# Altium schematic sheet Power.SchDoc: ALICE FIT CFD Mezzanine
size 420 x 297 mm; CheckedBy: G.Kasprowicz; Author: INR Moscow; CompanyName: WUT ISE; DrawnBy: Maciej Podgóski; Organization: WUT ISE; Address1: PW ISE; Address2: Nowowiejska 15/19 00-665 Warsaw; Address3: gkasprow@gmail.com; DocumentNumber: 4; Revision: 2; SheetNumber: 4; SheetTotal: 5; ModifiedBy: -; CheckedDate: -; Title2: Power supply; DivGrp: WUT ISE; Designer: INR Moscow; ModifiedDate: -; ProjectName: Sensor Box
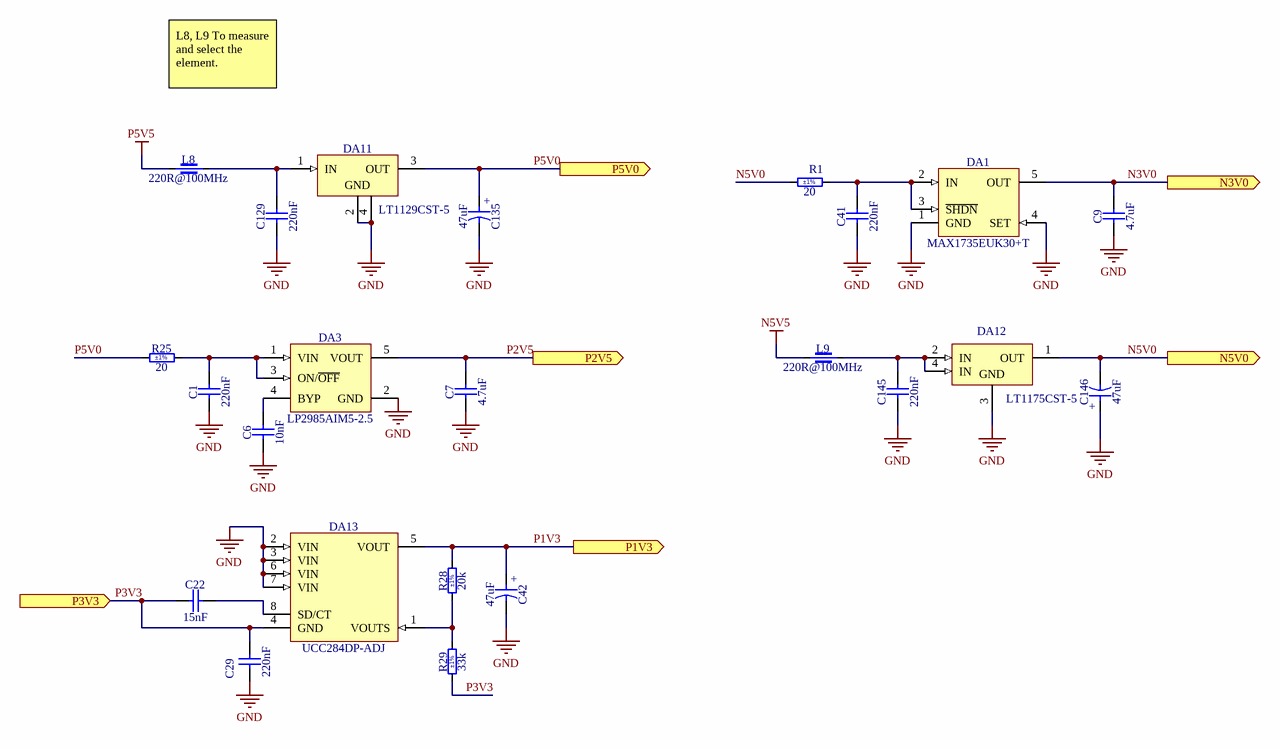
[diagram p0: Power.SchDoc]

## Parts
C1  220nF  [CAPC2012X135N]
C6  10nF  [CAPC2012X135N]
C7  4.7uF  [CAPC2012X135N]
C9  4.7uF  [CAPC2012X135N]
C22  15nF  [CAPC2012X135N]
C29  220nF  [CAPC2012X135N]
C41  220nF  [CAPC2012X135N]
C42  47uF  [CAPAE530X610N]
C129  220nF  [CAPC2012X135N]
C135  47uF  [CAPAE530X610N]
C145  220nF  [CAPC2012X135N]
C146  47uF  [CAPAE530X610N]
DA1  MAX1735EUK30+T  [SOT95P280X145-5N]
DA3  LP2985AIM5-2.5  [SOT95P280X145-5N]
DA11  LT1129CST-5  [SOT230P700X180-4N]
DA12  LT1175CST-5  [SOT230P700X180-4N]
DA13  UCC284DP-ADJ  [SOIC127P600X175-8N]
L8  220R@100MHz  [INDC2012X105N]
L9  220R@100MHz  [INDC2012X105N]
R1  20  Tolerance: ±1%  [RESC2012X60N]
R25  20  Tolerance: ±1%  [RESC2012X60N]
R28  20k  Tolerance: ±1%  [RESC2012X60N]
R29  33k  Tolerance: ±1%  [RESC2012X60N]

## Ports
N3V0 (out), N5V0 (out), P1V3 (out), P2V5 (out), P3V3 (in), P5V0 (out)

## Nets
GND: C1.1 C6.1 C7.1 C9.1 C29.1 C41.1 C42.2 C129.1 C135.2 C145.1 C146.1 DA1.1(GND) DA1.4(SET) DA3.2(GND) DA11.2(GND) DA11.4(GND) DA12.3(GND) DA13.2(VIN) DA13.3(VIN) DA13.6(VIN) DA13.7(VIN)
N5V5: L9.1
P5V5: L8.1
N3V0: C9.2 DA1.5(OUT) ; port N3V0
N5V0: C146.2 DA12.1(OUT) R1.1 ; port N5V0
P1V3: C42.1 DA13.5(VOUT) R28.2 ; port P1V3
P2V5: C7.2 DA3.5(VOUT) ; port P2V5
P3V3: C22.1 C29.2 DA13.4(GND) R29.1 ; port P3V3
P5V0: C135.1 DA11.3(OUT) R25.1 ; port P5V0
NetC1_2: C1.2 DA3.1(VIN) DA3.3(ON/~{OFF}) R25.2
NetC6_2: C6.2 DA3.4(BYP)
NetC22_2: C22.2 DA13.8(SD/CT)
NetC41_2: C41.2 DA1.2(IN) DA1.3(~{SHDN}) R1.2
NetC129_2: C129.2 DA11.1(IN) L8.2
NetC145_2: C145.2 DA12.2(IN) DA12.4(IN) L9.2
NetDA13_1: DA13.1(VOUTS) R28.1 R29.2

## Notes on the sheet
- L8, L9 To measure and select the element.
- Project/Equipment
- Document
- Designer
- Drawn by
- Check.by
- Copyright WUT ISE 2024.
  This documentation describes Open Hardware and is licensed under the CERN OHL v.2. You may redistribute and modify this documentation under the terms of the CERN OHL v.2. (http://ohwr.org/CERNOHL). This documentation is distributed WITHOUT ANY EXPRESS OR IMPLIED WARRANTY, INCLUDING OF MERCHANTABILITY, SATISFACTORY QUALITY AND FITNESS FOR A PARTICULAR PURPOSE. Please see the CERN OHL v.2 for applicable conditions.
- Contact
- File
- Last Mod.
- Print Date
- Sheet
- Size
- A3
- of
- Rev
- (in symbol CAE530-610_47UF_16V_20%) +

## Library data of the parts
C1 C29 C41 C129 C145 = CC0805_220NF_50V_10%_X7R: Non-polarised capacitor; Part Description: SMD Multilayer Chip Ceramic Capacitor; Manufacturer: GENERIC; Manufacturer1 Part Number: GRM21BR71H224KA01L; Voltage: 50V; TC: X7R; Tolerance: ±10%; Part Number: CC0805_220NF_50V_10%_X7R; Component Kind: Standard; Component Type: Standard; Pin Count: 2; Value: 220nF; Status: Preferred; Manufacturer Part Number: CC0805_220NF_50V_10%_X7R; Case: 0805; Mounted: Yes; Socket: No; SMD: Yes; Sense: No; Manufacturer1 Example: MURATA; Manufacturer1 ComponentHeight: 1.35mm; HelpURL: \\cern.ch\dfs\Applications\Altium\Datasheets\CC0805_X7R_MURATA.pdf; Author: CERN DEM JLC; CreateDate: 03.12.2007; LatestRevisionDate: 03.12.2007
C6 = CC0805_10NF_50V_5%_C0G: Non-polarised capacitor; Part Description: SMD Multilayer Chip Ceramic Capacitor; Manufacturer: GENERIC; Manufacturer1 Part Number: C0805C103J5GACTU; Voltage: 50V; TC: C0G/NP0; Tolerance: ±5%; Part Number: CC0805_10NF_50V_5%_C0G; Component Kind: Standard; Component Type: Standard; Pin Count: 2; Value: 10nF; Status: None; Manufacturer Part Number: CC0805_10NF_50V_5%_C0G; Case: 0805; Mounted: Yes; Socket: No; SMD: Yes; Sense: No; Manufacturer1 Example: KEMET; Manufacturer1 ComponentHeight: 0.88mm; HelpURL: \\cern.ch\dfs\Applications\Altium\Datasheets\CC0805_C0G_KEMET_(Commercial Grade).pdf; Author: CERN DEM JLC; CreateDate: 02.02.2011; LatestRevisionDate: 22.04.2015
C7 C9 = CC0805_4.7UF_16V_10%_X7R: Non-polarised capacitor; Part Description: SMD Multilayer Chip Ceramic Capacitor; Manufacturer: GENERIC; Manufacturer1 Part Number: EMK212B7475KG-T; Voltage: 16V; TC: X7R; Tolerance: ±10%; Part Number: CC0805_4.7UF_16V_10%_X7R; Component Kind: Standard; Component Type: Standard; Pin Count: 2; Value: 4.7uF; Status: Preferred; Manufacturer Part Number: CC0805_4.7UF_16V_10%_X7R; Case: 0805; Mounted: Yes; Socket: No; SMD: Yes; Sense: No; Manufacturer1 Example: TAIYO YUDEN; Manufacturer1 ComponentHeight: 1.35mm; HelpURL: \\cern.ch\dfs\Applications\Altium\Datasheets\CC0805_X7R_TAIYO-YUDEN_HIGH-VALUE.pdf; Author: CERN DEM JLC; CreateDate: 16.09.2014; LatestRevisionDate: 16.09.2014
C22 = CC0805_15NF_50V_10%_X7R: Non-polarised capacitor; Part Description: SMD Multilayer Chip Ceramic Capacitor; Manufacturer: GENERIC; Manufacturer1 Part Number: 223858615638; Voltage: 50V; TC: X7R; Tolerance: ±10%; Part Number: CC0805_15NF_50V_10%_X7R; Component Kind: Standard; Component Type: Standard; Pin Count: 2; Value: 15nF; Status: Preferred; Manufacturer Part Number: CC0805_15NF_50V_10%_X7R; Case: 0805; Mounted: Yes; Socket: No; SMD: Yes; Sense: No; Manufacturer1 Example: PHYCOMP; Manufacturer1 ComponentHeight: 1.35mm; HelpURL: \\cern.ch\dfs\Applications\Altium\Datasheets\CC0805_X7R_PHYCOMP.pdf; Author: CERN DEM JLC; CreateDate: 03.12.2007; LatestRevisionDate: 03.12.2007
C42 C135 C146 = CAE530-610_47UF_16V_20%: Polarised capacitor; Part Description: Conductive Polymer Hybrid Aluminum Electrolytic Capacitor; Manufacturer: CHEMI-CON; Manufacturer Part Number: HHXD160ARA470ME61G; Voltage: 16V; Tolerance: ±20%; Part Number: CAE530-610_47UF_16V_20%; Component Kind: Standard; Component Type: Standard; Pin Count: 2; Value: 47uF; Status: Not Recommended; Case: C; Mounted: Yes; Socket: No; SMD: Yes; Sense: No; ComponentHeight: 6.1mm; HelpURL: \\cern.ch\dfs\Applications\Altium\Datasheets\CAE_CHIMI-CON_HXD.pdf; Author: CERN DEM HF; CreateDate: 15.04.2024; LatestRevisionDate: 15.04.2024
DA1 = MAX1735EUK30+T: 200mA, Negative-Output, Low-Dropout Linear Regulator; Part Description: 3V, 200mA, Negative-Output, Low-Dropout Linear Regulator; Manufacturer: MAXIM; PressFit: No; Bonding: No; Part Number: MAX1735EUK30+T; Component Kind: Standard; Component Type: Standard; Device: MAX1735EUK30+T; PackageDescription: SOT23, 0.95mm Pitch; 5 Pin, 1.60mm W X 2.90mm L X 1.45mm H body, IPC Medium Density; Manufacturer Part Number: MAX1735EUK30; Pin Count: 5; Case: SOT23-5; Mounted: Yes; Socket: No; SMD: Yes; Sense: No; ComponentHeight: 1.45mm; HelpURL: \\cern.ch\dfs\Applications\Altium\Datasheets\MAX1735EUK30+T.pdf; Author: CERN DEM JLC; CreateDate: 17.02.2010; LatestRevisionDate: 04.04.2022
DA3 = LP2985AIM5-2.5: 150mA Low-Noise Low-Dropout Regulator Whit Shutdown; Part Description: 2.5V, 150mA Low-Noise Low-Dropout Regulator Whit Shutdown; Manufacturer: TEXAS INSTRUMENTS; PressFit: No; Bonding: No; Part Number: LP2985AIM5-2.5; Component Kind: Standard; Component Type: Standard; Device: LP2985AIM5-2.5; PackageDescription: SOT23, 0.95mm Pitch; 5 Pin, 1.60mm W X 2.90mm L X 1.45mm H body, IPC Medium Density; Manufacturer Part Number: LP2985AIM5-2.5; Pin Count: 5; Case: SOT23-5; Mounted: Yes; Socket: No; SMD: Yes; Sense: No; ComponentHeight: 1.45mm; HelpURL: \\cern.ch\dfs\Applications\Altium\Datasheets\LP2985AIM5.pdf; Author: CERN DEM HF; CreateDate: 16.04.2024; LatestRevisionDate: 16.04.2024
DA11 = LT1129CST-5: 3-Terminal Regulator 1=IN 2=GND 3=OUT 4=GND; Part Description: 5V, 700mA Micropower Low Dropout Regulator with Shutdown; Manufacturer: LINEAR TECHNOLOGY; PressFit: No; Bonding: No; Part Number: LT1129CST-5; Component Kind: Standard; Component Type: Standard; Device: LT1129CST-5; PackageDescription: SOT223, 2.30mm Pitch; 4 Pin, 3.70mm W X 6.70mm L X 1.80mm H body, IPC Medium Density; Manufacturer Part Number: LT1129CST-5; Pin Count: 4; Case: SOT223; Mounted: Yes; Socket: No; SMD: Yes; Sense: No; ComponentHeight: 1.8mm; HelpURL: \\cern.ch\dfs\Applications\Altium\Datasheets\LT1129.pdf; Author: CERN DEM HF; CreateDate: 16.04.2024; LatestRevisionDate: 16.04.2024
DA12 = LT1175CST-5: 3-Terminal Regulator 1=OUT 2=IN 3=GND 4=IN; Part Description: 5V 500mA Negative Low Dropout Micropower Regulator; Manufacturer: LINEAR TECHNOLOGY; PressFit: No; Bonding: No; Part Number: LT1175CST-5; Component Kind: Standard; Component Type: Standard; Device: LT1175CST-5; PackageDescription: SOT223, 2.30mm Pitch; 4 Pin, 3.70mm W X 6.70mm L X 1.80mm H body, IPC Medium Density; Manufacturer Part Number: LT1175CST-5; Pin Count: 4; Case: SOT223; Mounted: Yes; Socket: No; SMD: Yes; Sense: No; ComponentHeight: 1.8mm; HelpURL: \\cern.ch\dfs\Applications\Altium\Datasheets\LT1175.pdf; Author: CERN DEM HF; CreateDate: 16.04.2024; LatestRevisionDate: 16.04.2024
DA13 = UCC284DP-ADJ: 5V, 500mA Low-Dropout Negative Linear Regulator; Part Description: 5V, 500mA Low-Dropout Negative Linear Regulator, Adjustable Output; Manufacturer: TEXAS INSTRUMENTS; PressFit: No; Bonding: No; Part Number: UCC284DP-ADJ; Component Kind: Standard; Component Type: Standard; Device: UCC284DP-ADJ; PackageDescription: SOIC 8, Pitch 1.27mm, Body 4x5mm, IPC Medium Density; Manufacturer Part Number: UCC284DP-ADJ; Pin Count: 8; Case: SOIC8; Mounted: Yes; Socket: No; SMD: Yes; Sense: No; ComponentHeight: 1.75mm; HelpURL: \\cern.ch\dfs\Applications\Altium\Datasheets\UCC284DP-ADJ.pdf; Author: CERN DEM BR; CreateDate: 20.06.2019; LatestRevisionDate: 20.06.2019
L8 L9 = IND0805_TDK_MPZ2012S221A: Part Description: SMT Chip Bead for General Power Line (MPZ Series); Manufacturer: TDK; Power: 3A; Resistance: 0.04R; Tolerance: ±25%; Part Number: IND0805_TDK_MPZ2012S221A; Component Kind: Standard; Component Type: Standard; Pin Count: 2; Value: 220R@100MHz; Manufacturer Part Number: MPZ2012S221A; Case: 0805; Mounted: Yes; Socket: No; SMD: Yes; Sense: No; ComponentHeight: 1.05mm; HelpURL: \\cern.ch\dfs\Applications\Altium\Datasheets\IND0805_TDK_MPZ2012.pdf; Author: CERN DEM HF; CreateDate: 04.10.2021; LatestRevisionDate: 04.10.2021
R1 R25 = R0805_20R_1%_0.125W_100PPM: Resistor - 1%; Part Description: General Purpose Thick Film Chip Resistor; Manufacturer: GENERIC; Manufacturer1 Part Number: NRC10F20R0TRF; Power: 0.125W; TC: ±100ppm/°C; PressFit: No; Part Number: R0805_20R_1%_0.125W_100PPM; Component Kind: Standard; Component Type: Standard; Pin Count: 2; Value: 20; Status: Preferred; Manufacturer Part Number: R0805_20R_1%_0.125W_100PPM; Case: 0805; Mounted: Yes; Sense: No; Socket: No; SMD: Yes; Manufacturer1 Example: NIC COMPONENT; Manufacturer1 ComponentHeight: 0.6mm; HelpURL: \\cern.ch\dfs\Applications\Altium\Datasheets\R0805_NIC_NRC.pdf; Author: CERN DEM JLC; CreateDate: 03.12.2007; LatestRevisionDate: 13.03.2008
R28 = R0805_20K_1%_0.125W_100PPM: Resistor - 1%; Part Description: General Purpose Thick Film Chip Resistor; Manufacturer: GENERIC; Manufacturer1 Part Number: NRC10F2002TRF; Power: 0.125W; TC: ±100ppm/°C; PressFit: No; Part Number: R0805_20K_1%_0.125W_100PPM; Component Kind: Standard; Component Type: Standard; Pin Count: 2; Value: 20k; Status: Preferred; Manufacturer Part Number: R0805_20K_1%_0.125W_100PPM; Case: 0805; Mounted: Yes; Sense: No; Socket: No; SMD: Yes; Manufacturer1 Example: NIC COMPONENT; Manufacturer1 ComponentHeight: 0.6mm; HelpURL: \\cern.ch\dfs\Applications\Altium\Datasheets\R0805_NIC_NRC.pdf; Author: CERN DEM JLC; CreateDate: 03.12.2007; LatestRevisionDate: 13.03.2008
R29 = R0805_33K_1%_0.125W_100PPM: Resistor - 1%; Part Description: General Purpose Thick Film Chip Resistor; Manufacturer: GENERIC; Manufacturer1 Part Number: NRC10F3302TRF; Power: 0.125W; TC: ±100ppm/°C; PressFit: No; Part Number: R0805_33K_1%_0.125W_100PPM; Component Kind: Standard; Component Type: Standard; Pin Count: 2; Value: 33k; Status: Preferred; Manufacturer Part Number: R0805_33K_1%_0.125W_100PPM; Case: 0805; Mounted: Yes; Sense: No; Socket: No; SMD: Yes; Manufacturer1 Example: NIC COMPONENT; Manufacturer1 ComponentHeight: 0.6mm; HelpURL: \\cern.ch\dfs\Applications\Altium\Datasheets\R0805_NIC_NRC.pdf; Author: CERN DEM JLC; CreateDate: 03.12.2007; LatestRevisionDate: 13.03.2008